# Altium schematic sheet 2020210905-jiajunliANALOG.SchDoc: ANALOG
size A4; CompanyName: BUPT; DrawnBy: LIJIAJUN; DocumentNumber: 20221212; Revision: 1.0; SheetNumber: 1; SheetTotal: 2
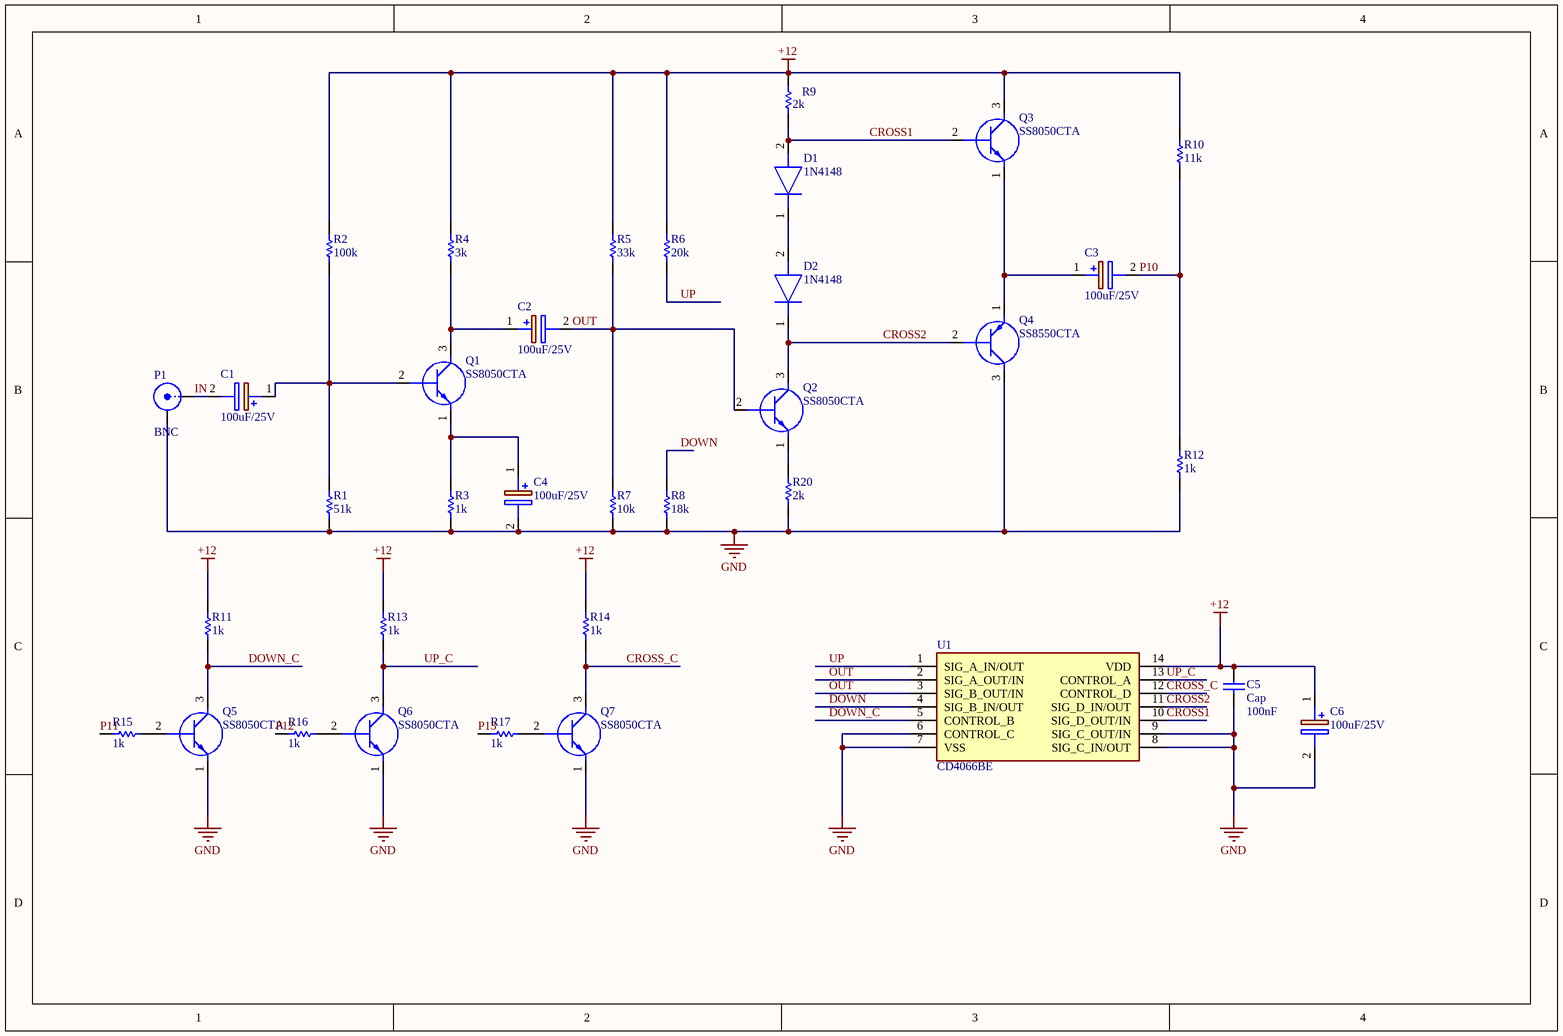
[diagram p0: 2020210905-jiajunliANALOG.SchDoc]

## Parts
C1  100uF/25V  [CAPPRD350W65D800H1250]
C2  100uF/25V  [CAPPRD350W65D800H1250]
C3  100uF/25V  [CAPPRD350W65D800H1250]
C4  100uF/25V  [CAPPRD350W65D800H1250]
C5  Cap  value 100nF  [RAD-0.2-cap]
C6  100uF/25V  [CAPPRD350W65D800H1250]
D1  1N4148  [DIOAD1068W53L380D172]
D2  1N4148  [DIOAD1068W53L380D172]
P1  BNC  [BNC_RA-CON]
Q1  SS8050CTA  [TO-92-3]
Q2  SS8050CTA  [TO-92-3]
Q3  SS8050CTA  [TO-92-3]
Q4  SS8550CTA  [TO-92-3]
Q5  SS8050CTA  [TO-92-3]
Q6  SS8050CTA  [TO-92-3]
Q7  SS8050CTA  [TO-92-3]
R1  51k  [RES-AXIAL-0.4]
R2  100k  [RES-AXIAL-0.4]
R3  1k  [RES-AXIAL-0.4]
R4  3k  [RES-AXIAL-0.4]
R5  33k  [RES-AXIAL-0.4]
R6  20k  [RES-AXIAL-0.4]
R7  10k  [RES-AXIAL-0.4]
R8  18k  [RES-AXIAL-0.4]
R9  2k  [RES-AXIAL-0.4]
R10  11k  [RES-AXIAL-0.4]
R11  1k  [RES-AXIAL-0.4]
R12  1k  [RES-AXIAL-0.4]
R13  1k  [RES-AXIAL-0.4]
R14  1k  [RES-AXIAL-0.4]
R15  1k  [RES-AXIAL-0.4]
R16  1k  [RES-AXIAL-0.4]
R17  1k  [RES-AXIAL-0.4]
R20  2k  [RES-AXIAL-0.4]
U1  CD4066BE  [DIP794W53P254L1930H508Q14N]

## Nets
+12: C5.2 C6.1(+) Q3.3(C) R2.2 R4.2 R5.2 R6.2 R9.2 R10.2 R11.2 R13.2 R14.2 U1.14(VDD)
GND: C4.2(-) C5.1 C6.2(-) P1.2(Y) Q4.3(C) Q5.1(E) Q6.1(E) Q7.1(E) R1.1 R3.1 R7.1 R8.1 R12.1 R20.1 U1.6(CONTROL_C) U1.7(VSS) U1.8(SIG_C_IN/OUT) U1.9(SIG_C_OUT/IN)
CROSS1: D1.2(A) Q3.2(B) R9.1 U1.10(SIG_D_OUT/IN)
CROSS2: D2.1(K) Q2.3(C) Q4.2(B) U1.11(SIG_D_IN/OUT)
CROSS_C: Q7.3(C) R14.1 U1.12(CONTROL_D)
DOWN: R8.2 U1.4(SIG_B_IN/OUT)
DOWN_C: Q5.3(C) R11.1 U1.5(CONTROL_B)
IN: C1.2(-) P1.1(X)
OUT: C2.2(-) Q2.2(B) R5.1 R7.2 U1.2(SIG_A_OUT/IN) U1.3(SIG_B_OUT/IN)
P10: C3.2(-) R10.1 R12.2
P11: R15.2
P12: R16.2
P13: R17.2
UP: R6.1 U1.1(SIG_A_IN/OUT)
UP_C: Q6.3(C) R13.1 U1.13(CONTROL_A)
NetC1_1: C1.1(+) Q1.2(B) R1.2 R2.1
NetC2_1: C2.1(+) Q1.3(C) R4.1
NetC3_1: C3.1(+) Q3.1(E) Q4.1(E)
NetC4_1: C4.1(+) Q1.1(E) R3.2
NetD1_1: D1.1(K) D2.2(A)
NetQ2_1: Q2.1(E) R20.2
NetQ5_2: Q5.2(B) R15.1
NetQ6_2: Q6.2(B) R16.1
NetQ7_2: Q7.2(B) R17.1

## Library data of the parts
C1-C4 C6 = ECA-1EEN101: Capacitor Polarised; Manufacturer_Name: Panasonic; Datasheet Link: https://www.mouser.in/datasheet/2/315/ABA0000C1044-947503.pdf; Height: 12.5mm; Manufacturer_Part_Number: ECA-1EEN101; Mouser Part Number: 667-ECA-1EEN101; Mouser Price/Stock: https://www.mouser.co.uk/ProductDetail/Panasonic/ECA-1EEN101?qs=tfZGHB2PWd0NYnCl82fG3g%3D%3D
C5 = Cap: Capacitor; Published: 8-Jun-2000; LatestRevisionDate: 17-Jul-2002; LatestRevisionNote: Re-released for DXP Platform.; PackageReference: RAD-0.3; Publisher: Altium Limited; PackageDescription: Radial Cap, Thru-Hole; 2 Leads; 0.3 in Pin Spacing
D1 D2 = 1N4148: Diode; Manufacturer_Name: onsemi; Manufacturer_Part_Number: 1N4148; Mouser Part Number: 512-1N4148; Mouser Price/Stock: https://www.mouser.co.uk/ProductDetail/ON-Semiconductor-Fairchild/1N4148?qs=i4Fj9T%2FoRm8RMUhj5DeFQg%3D%3D; Arrow Part Number: 1N4148; Arrow Price/Stock: https://www.arrow.com/en/products/1n4148/on-semiconductor?region=europe
P1 = BNC: BNC Elbow Connector; LatestRevisionDate: 17-Jul-2002; LatestRevisionNote: Re-released for DXP Platform.; Publisher: Altium Limited
Q1-Q3 Q5-Q7 = SS8050CTA: Transistor BJT NPN; Manufacturer_Name: onsemi; Datasheet Link: http://www.onsemi.com/pub/Collateral/SS8050-D.pdf; Manufacturer_Part_Number: SS8050CTA; Mouser Part Number: 512-SS8050CTA; Mouser Price/Stock: https://www.mouser.co.uk/ProductDetail/ON-Semiconductor-Fairchild/SS8050CTA?qs=UMEuL5FsraCvGU9pAIJ0vg%3D%3D; Arrow Part Number: SS8050CTA; Arrow Price/Stock: https://www.arrow.com/en/products/ss8050cta/on-semiconductor?region=europe
Q4 = SS8550CTA: Transistor BJT PNP; Manufacturer_Name: onsemi; Datasheet Link: https://www.onsemi.com/pub/Collateral/SS8550-D.pdf; Manufacturer_Part_Number: SS8550CTA; Mouser Part Number: 512-SS8550CTA; Mouser Price/Stock: https://www.mouser.co.uk/ProductDetail/ON-Semiconductor-Fairchild/SS8550CTA?qs=UMEuL5FsraCgmcObR%2FdvUQ%3D%3D; Arrow Part Number: SS8550CTA; Arrow Price/Stock: https://www.arrow.com/en/products/ss8550cta/on-semiconductor?region=nac
R1 R3-R17 R20 = Res1: Resistor; Value: 100K; Published: 8-Jun-2000; LatestRevisionDate: 17-Jul-2002; LatestRevisionNote: Re-released for DXP Platform.; PackageReference: AXIAL-0.3; Publisher: Altium Limited; PackageDescription: Axial Device, Thru-Hole; 2 Leads; 0.3 in Pin Spacing
R2 = Res1: Resistor; Published: 8-Jun-2000; LatestRevisionDate: 17-Jul-2002; LatestRevisionNote: Re-released for DXP Platform.; PackageReference: AXIAL-0.3; Publisher: Altium Limited; PackageDescription: Axial Device, Thru-Hole; 2 Leads; 0.3 in Pin Spacing; Value: 100K
U1 = CD4066BE: Integrated Circuit; Manufacturer_Name: Texas Instruments; Datasheet Link: https://datasheet.datasheetarchive.com/originals/distributors/Datasheets-SFU2/DSASFU100028824.pdf; Height: 5.08mm; Manufacturer_Part_Number: CD4066BE; Mouser Part Number: 595-CD4066BE; Mouser Price/Stock: https://www.mouser.co.uk/ProductDetail/Texas-Instruments/CD4066BE?qs=mTHRaKC2c7ObpofRtjqLig%3D%3D; Arrow Part Number: CD4066BE; Arrow Price/Stock: https://www.arrow.com/en/products/cd4066be/texas-instruments?region=nac